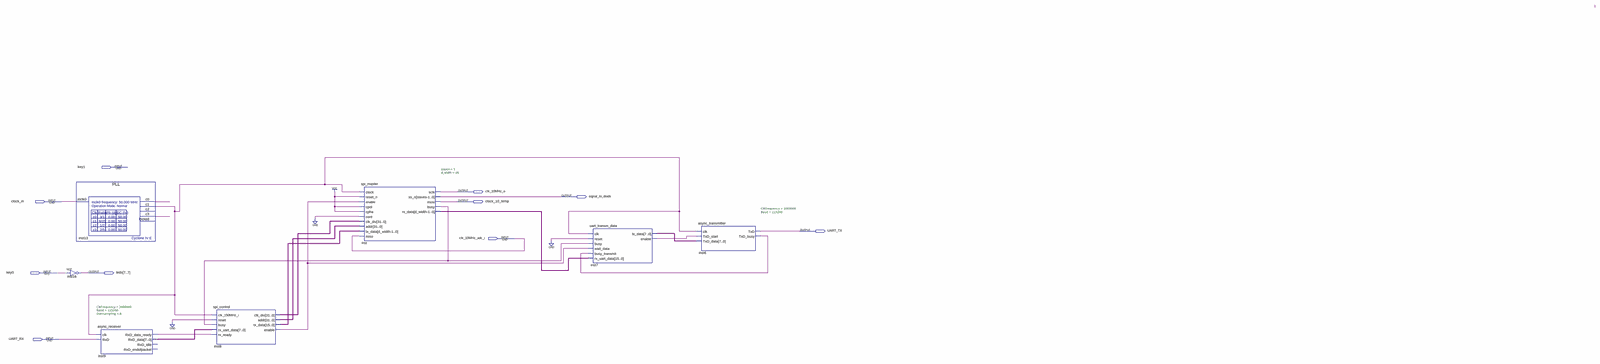
[diagram p0: schematic sheet, whole]
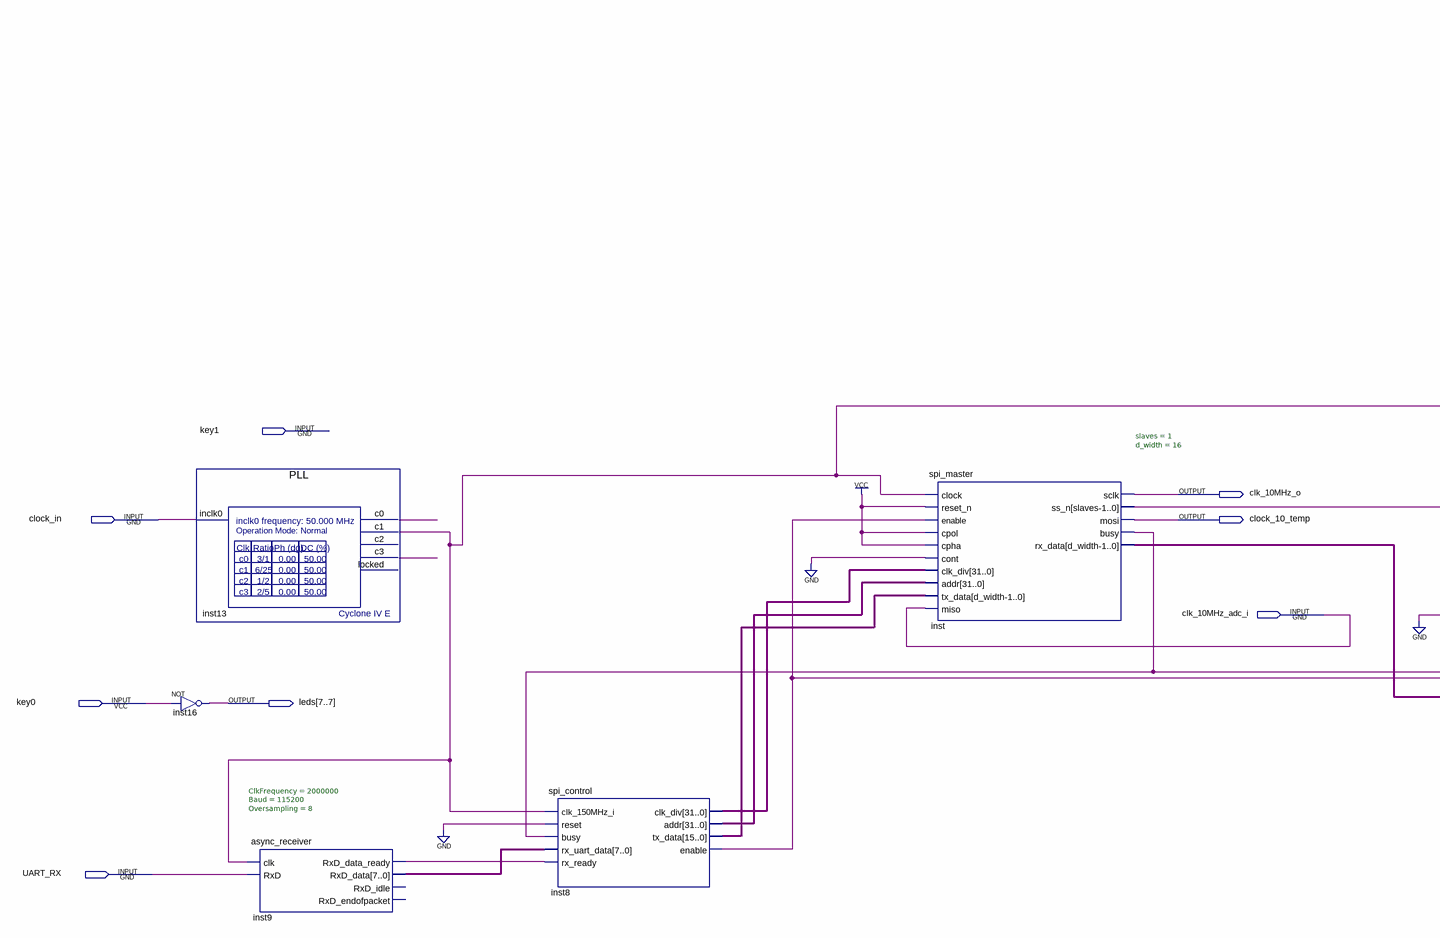
[diagram p1: schematic sheet, left part]
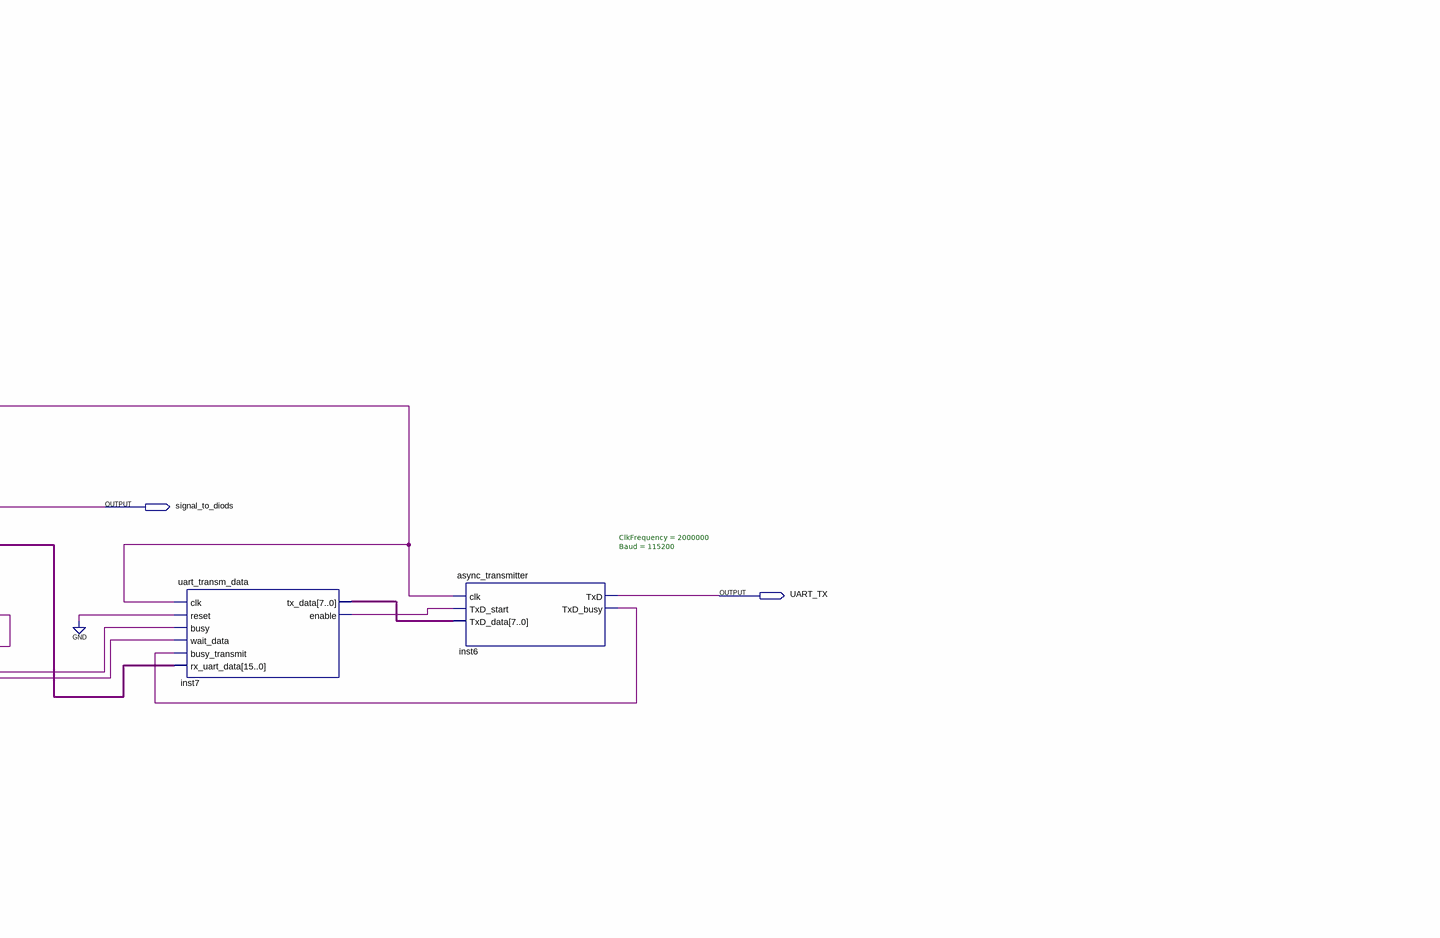
[diagram p2: schematic sheet, centre part]
// Quartus schematic top_file.bdf as structural Verilog: 7 symbols, 10 pins
module top_file (
  input  key1,
  input  clock_in,
  input  clk_10MHz_adc_i,
  input  key0,
  input  UART_RX,
  output clk_10MHz_o,
  output signal_to_diods,
  output clock_10_temp,
  output UART_TX,
  output [7:7] leds
);

  wire inst6_txd_busy, inst7_enable, inst8_enable, inst9_rxd_data_ready, inst13_c0, inst13_c1, inst13_c3,
       inst_busy;
  wire [7:0] inst7_tx_data, inst9_rxd_data;
  wire [15:0] inst8_tx_data, inst_rx_data;
  wire [31:0] inst8_addr, inst8_clk_div;

  PLL inst13 (.inclk0(clock_in), .c0(inst13_c0), .c1(inst13_c1), .c3(inst13_c3));  // open: c2, locked
  not inst16 (leds[7], key0);
  async_receiver #(.ClkFrequency(2000000), .Baud(115200), .Oversampling(8)) inst9 (
    .clk(inst13_c1), .RxD(UART_RX), .RxD_data_ready(inst9_rxd_data_ready), .RxD_data(inst9_rxd_data));  // open: RxD_idle, RxD_endofpacket
  spi_control inst8 (
    .clk_150MHz_i(inst13_c1), .reset(1'b0), .busy(inst_busy), .rx_uart_data(inst9_rxd_data),
    .rx_ready(inst9_rxd_data_ready), .clk_div(inst8_clk_div), .addr(inst8_addr), .tx_data(inst8_tx_data),
    .enable(inst8_enable));
  spi_master #(.slaves(1), .d_width(16)) inst (
    .clock(inst13_c1), .reset_n(1'b1), .enable(inst8_enable), .cpol(1'b1), .cpha(1'b1), .cont(1'b0),
    .clk_div(inst8_clk_div), .addr(inst8_addr), .tx_data(inst8_tx_data), .miso(clk_10MHz_adc_i),
    .sclk(clk_10MHz_o), .ss_n(signal_to_diods), .mosi(clock_10_temp), .busy(inst_busy), .rx_data(inst_rx_data));
  uart_transm_data inst7 (
    .clk(inst13_c1), .reset(1'b0), .busy(inst_busy), .wait_data(inst8_enable),
    .busy_transmit(inst6_txd_busy), .rx_uart_data(inst_rx_data), .tx_data(inst7_tx_data),
    .enable(inst7_enable));
  async_transmitter #(.ClkFrequency(2000000), .Baud(115200)) inst6 (
    .clk(inst13_c1), .TxD_start(inst7_enable), .TxD_data(inst7_tx_data), .TxD(UART_TX),
    .TxD_busy(inst6_txd_busy));
endmodule
